# Altium schematic sheet FC31M2-32.768-NTLNNDTL.schdoc
size 127 x 101 mm
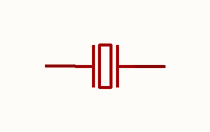
[diagram p0: FC31M2-32.768-NTLNNDTL.schdoc]

## Parts
U?  fc31m2-32.768-ntlnndtl  [CRYSTAL-SMD_L3.2-W1.5]  (value not drawn)

## Nets

Not connected (* = marked no-connect by the designer): U? 1 2

## Library data of the parts
U? = fc31m2-32.768-ntlnndtl: 晶振类型:贴片晶振;频率:32.768kHz;常温频差:±10ppm;负载电容:12.5pF;频率稳定度:±10ppm;; Manufacturer: HCI(杭晶); AddInBom: yes; ModelId: 762d7afc596f4558a373612390f4386d; ModelName: CRYSTAL-SMD_L3.2-W1.5-1; ModelTransform: 125.984,59.055,0,0,0,0,0,0,0; Normal temperature Frequency Tolerance: ±10ppm; Load Capacitance: 12.5pF; Equivalent Series Resistance(ESR): 70kΩ; Symbol: FC31M2-32.768-NTLNNDTL; LCSC Part Name: 3215 2P 32.768kHz 12.5pF ±10ppm -40~+85℃(±10ppm); SupplierPart: C5120559; ManufacturerPart: FC31M2-32.768-NTLNNDTL; Supplier Footprint: SMD3215-2P; JLCPCB Part Class: Extended Part; Datasheet: https://item.szlcsc.com/datasheet/FC31M2-32.768-NTLNNDTL/5705379.html; Supplier: LCSC; ConvertToPcb: yes; FootprintName: CRYSTAL-SMD_L3.2-W1.5; Type: 贴片晶振; Value: 32.768kHz; Frequency Stability: ±10ppm; Operating Temperature: -40℃~+85℃